# EAGLE design SNES_BOARD (EAGLE 7.7.0)
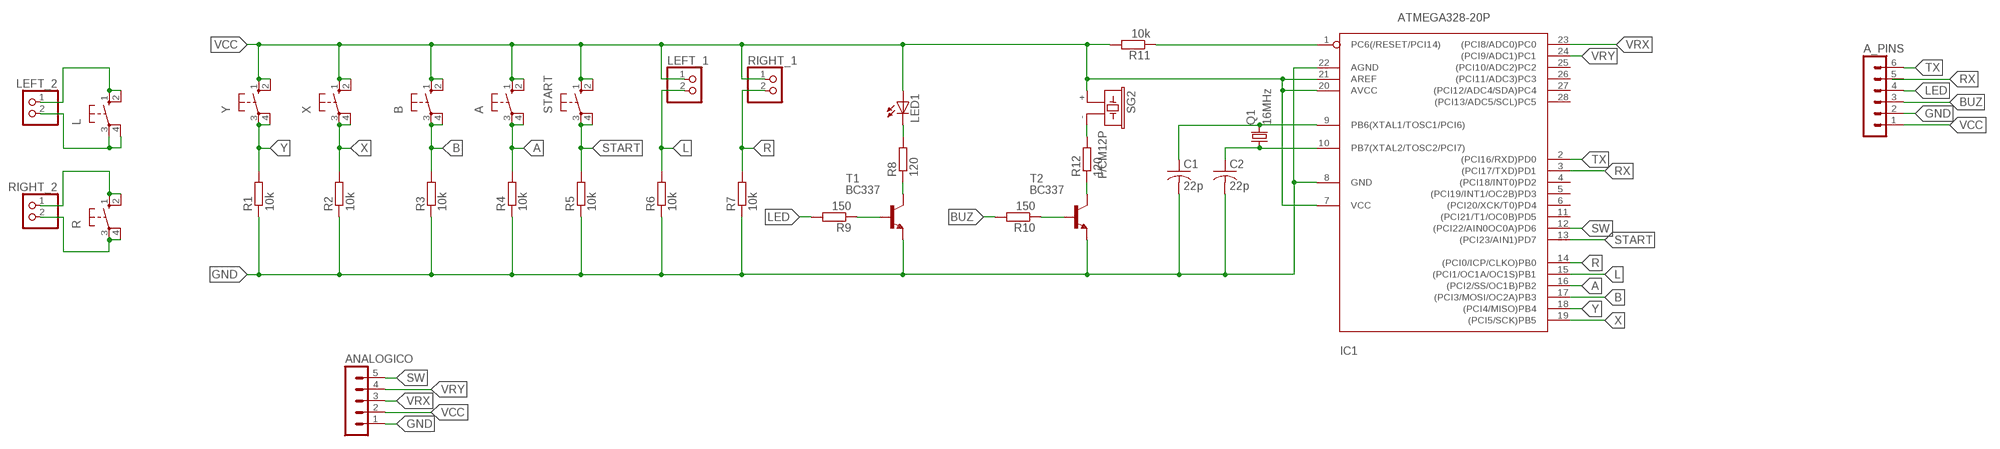
[diagram p0: schematic, sheet 1]

## Parts
A  10-XX  [B3F-10XX]
A_PINS  MA06-1  [MA06-1]
ANALOGICO  MA05-1  [MA05-1]
B  10-XX  [B3F-10XX]
C1  22p  C-US025-025X050  [C025-025X050]
C2  22p  C-US025-025X050  [C025-025X050]
IC1  ATMEGA328-20P  [DIL28-3]
L  10-XX  [B3F-10XX]
LED1  LED5MM  [LED5MM]
LEFT_1  PINHD-1X2  [1X02]
LEFT_2  PINHD-1X2  [1X02]
Q1  16MHz  CRYSTALHC49U-V  [HC49U-V]
R  10-XX  [B3F-10XX]
R1  10k  R-EU_0207/12  [0207/12]
R2  10k  R-EU_0207/12  [0207/12]
R3  10k  R-EU_0207/12  [0207/12]
R4  10k  R-EU_0207/12  [0207/12]
R5  10k  R-EU_0207/12  [0207/12]
R6  10k  R-EU_0207/12  [0207/12]
R7  10k  R-EU_0207/12  [0207/12]
R8  120  R-EU_0207/12  [0207/12]
R9  150  R-EU_0207/12  [0207/12]
R10  150  R-EU_0207/12  [0207/12]
R11  10k  R-EU_0207/12  [0207/12]
R12  120  R-EU_0207/12  [0207/12]
RIGHT_1  PINHD-1X2  [1X02]
RIGHT_2  PINHD-1X2  [1X02]
SG2  F/CM12P  [F/CM12P]
START  10-XX  [B3F-10XX]
T1  BC337  [TO92]
T2  BC337  [TO92]
X  10-XX  [B3F-10XX]
Y  10-XX  [B3F-10XX]

## Nets
A: A.3(P) A.4(P1) IC1.16((PCI2/SS/OC1B)PB2) R4.2
B: B.3(P) B.4(P1) IC1.17((PCI3/MOSI/OC2A)PB3) R3.2
BUZ: A_PINS.3 R10.2
GND: A_PINS.2 ANALOGICO.1 C1.2 C2.2 IC1.8(GND) IC1.22(AGND) R1.1 R2.1 R3.1 R4.1 R5.1 R6.1 R7.1 T1.1(E) T2.1(E)
L: IC1.15((PCI1/OC1A/OC1S)PB1) LEFT_1.2 R6.2
LED: A_PINS.4 R9.2
N$1: LED1.K(C) R8.2
N$2: L.1(S) L.2(S1) LEFT_2.1
N$3: L.3(P) L.4(P1) LEFT_2.2
N$4: R.1(S) R.2(S1) RIGHT_2.1
N$5: R.3(P) R.4(P1) RIGHT_2.2
N$6: R8.1 T1.3(C)
N$7: R9.1 T1.2(B)
N$8: R12.2 SG2.-
N$9: R10.1 T2.2(B)
N$10: IC1.1(PC6(/RESET/PCI14)) R11.1
N$13: C1.1 IC1.9(PB6(XTAL1/TOSC1/PCI6)) Q1.2
N$14: C2.1 IC1.10(PB7(XTAL2/TOSC2/PCI7)) Q1.1
N$18: R12.1 T2.3(C)
R: IC1.14((PCI0/ICP/CLKO)PB0) R7.2 RIGHT_1.2
RX: A_PINS.5 IC1.3((PCI17/TXD)PD1)
START: IC1.13((PCI23/AIN1)PD7) R5.2 START.3(P) START.4(P1)
SW: ANALOGICO.5 IC1.12((PCI22/AIN0OC0A)PD6)
TX: A_PINS.6 IC1.2((PCI16/RXD)PD0)
VCC: A.1(S) A.2(S1) A_PINS.1 ANALOGICO.2 B.1(S) B.2(S1) IC1.7(VCC) IC1.20(AVCC) IC1.21(AREF) LED1.A LEFT_1.1 R11.2 RIGHT_1.1 SG2.+ START.1(S) START.2(S1) X.1(S) X.2(S1) Y.1(S) Y.2(S1)
VRX: ANALOGICO.3 IC1.23((PCI8/ADC0)PC0)
VRY: ANALOGICO.4 IC1.24((PCI9/ADC1)PC1)
X: IC1.19((PCI5/SCK)PB5) R2.2 X.3(P) X.4(P1)
Y: IC1.18((PCI4/MISO)PB4) R1.2 Y.3(P) Y.4(P1)
Unconnected: IC1.4((PCI18/INT0)PD2) IC1.5((PCI19/INT1/OC2B)PD3) IC1.6((PCI20/XCK/T0)PD4) IC1.11((PCI21/T1/OC0B)PD5) IC1.25((PCI10/ADC2)PC2) IC1.26((PCI11/ADC3)PC3) IC1.27((PCI12/ADC4/SDA)PC4) IC1.28((PCI13/ADC5/SCL)PC5)

## Library data of the parts
A B L R START X Y = switch-omron:10-XX: OMRON SWITCH; MPN: B3F-1000; OC_FARNELL: 176432; OC_NEWARK: 36M3542
A_PINS = con-lstb:MA06-1: PIN HEADER; OC_FARNELL: unknown; OC_NEWARK: unknown
ANALOGICO = con-lstb:MA05-1: PIN HEADER; OC_FARNELL: unknown; OC_NEWARK: unknown
C1 C2 = adafruit:C-US: CAPACITOR, American symbol
IC1 = atmega328:ATMEGA328*P: MICROCONTROLLER 32 kBytes FLASH 2 kBytes SRAM 1 kBytes EEPROM USART 8-channel 10 bit ADC
LED1 = adafruit:LED: LED OSRAM: - CHIPLED LG R971, LG N971, LY N971, LG Q971, LY Q971, LO R971, LY R971 LH N974, LH R974 LS Q976, LO Q976, LY Q976 LO Q996 - Hyper CHIPLED LW Q18S LB Q993, LB Q99A, LB R99A - SideLED LS A670, LO A670, LY A670, LG A670, LP A670 LB A673, LV A673, LT A673, LW A673 LH A674 LY A675 LS A676, LA A676, LO A676, LY A676, LW A676 LS A679, LY A679, LG A679 - Hyper Micro SIDELED® LS Y876, LA Y876, LO Y876, LY Y876 LT Y87S - SmartLED LW L88C, LW L88S LB L89C, LB L89S, LG L890 LS L89K, LO L89K, LY L89K LS L896, LA L896, LO L896, LY L896 - TOPLED LS T670, LO T670, LY T670, LG T670, LP T670 LSG T670, LSP T670, LSY T670, LOP T670, LYG T670 LG T671, LOG T671, LSG T671 LB T673, LV T673, LT T673, LW T673 LH T674 LS T676, LA T676, LO T676, LY T676, LB T676, LH T676, LSB T676, LW T676 LB T67C, LV T67C, LT T67C, LS T67K, LO T67K, LY T67K, LW E67C LS E67B, LA E67B, LO E67B, LY E67B, LB E67C, LV E67C, LT E67C LW T67C LS T679, LY T679, LG T679 LS T770, LO T770, LY T770, LG T770, LP T770 LB T773, LV T773, LT T773, LW T773 LH T774 LS E675, LA E675, LY E675, LS T675 LS T776, LA T776, LO T776, LY T776, LB T776 LHGB T686 LT T68C, LB T68C - Hyper Mini TOPLED® LB M676 - Mini TOPLED Santana® LG M470 LS M47K, LO M47K, LY M47K Source: http://www.osram.convergy.de/
LEFT_1 LEFT_2 RIGHT_1 RIGHT_2 = pinhead:PINHD-1X2: PIN HEADER
Q1 = crystal:CRYSTAL: CRYSTAL; OC_FARNELL: 1666969; OC_NEWARK: unknown
R1-R12 = rcl:R-EU_: RESISTOR, European symbol
SG2 = buzzer:F/CM12P: BUZZER Source: Buerklin; OC_FARNELL: unknown; OC_NEWARK: unknown
T1 T2 = transistor:BC337: NPN TRANSISTOR

## Board
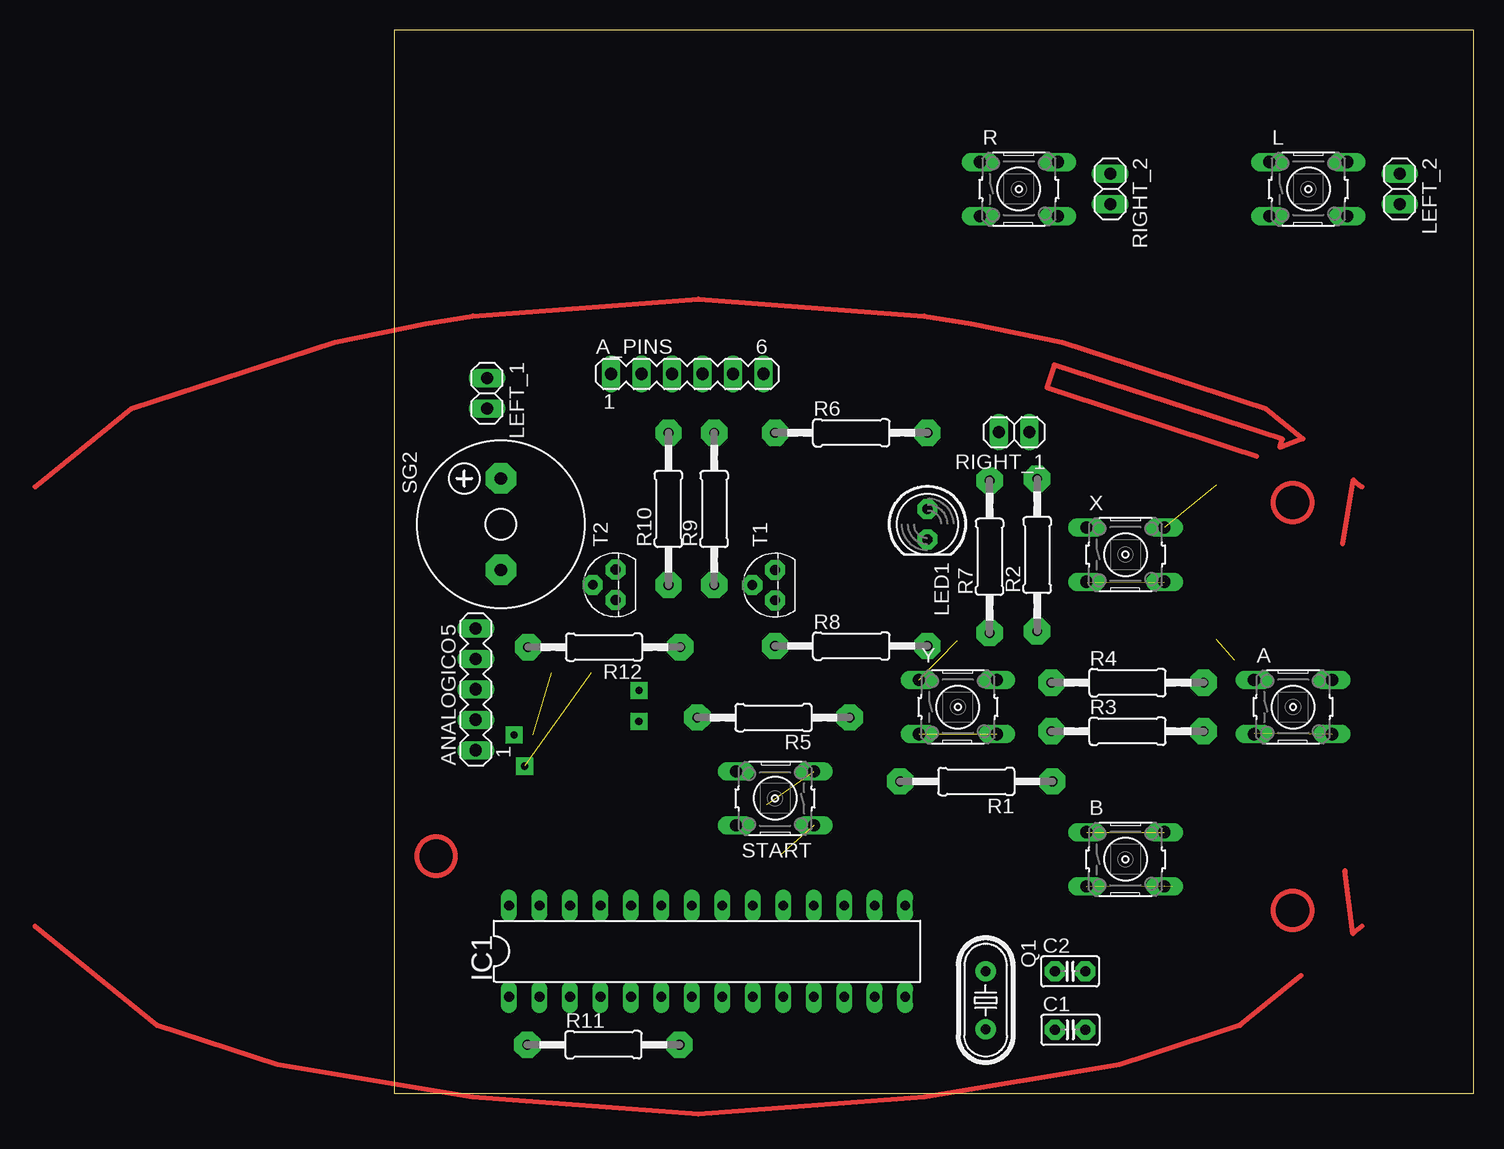
[diagram p1: board, top side]
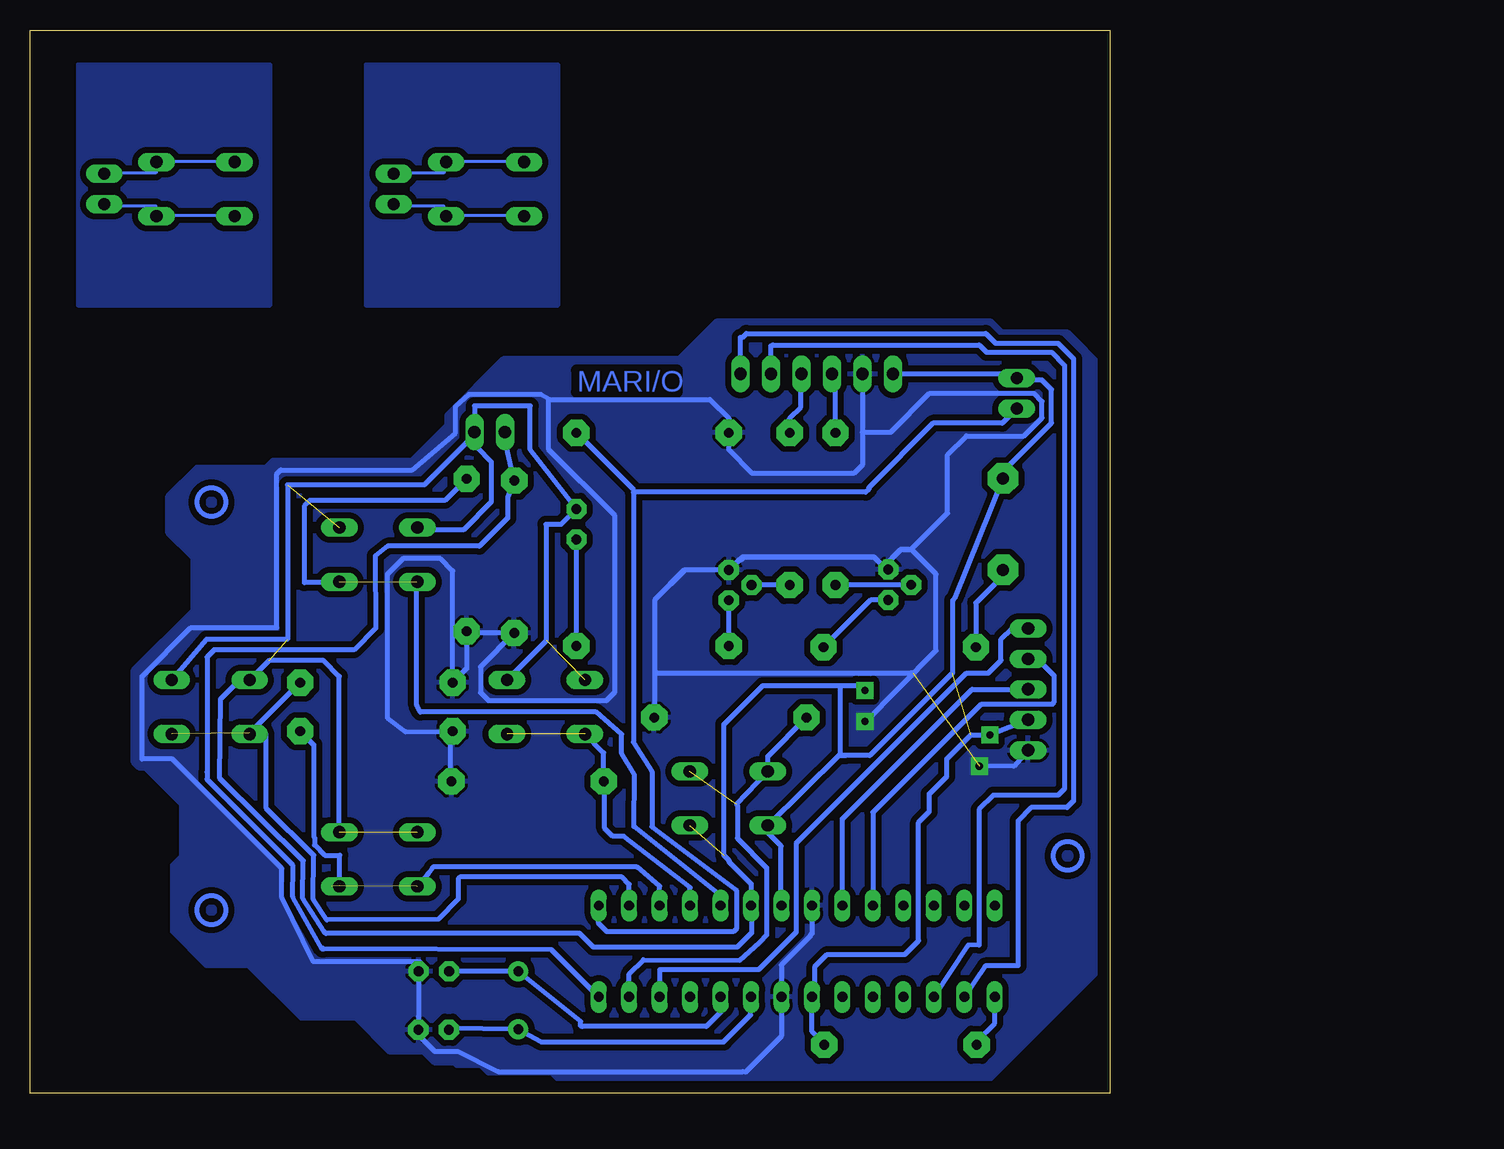
[diagram p2: board, bottom side, seen from below]

Size 90 x 88.65 mm. Coordinates in mm from the lower left corner, seen from the top.
Outline: 0,0 90,0 90,88.65 0,88.65 0,0
Copper layers (1*16): Top 0.035mm / dielectric 1.5mm / Bottom 0.035mm
Design rules "default *": minimum track width 30mil, minimum drill 24mil, track to track 10mil, track to pad 20mil, pad to pad 8mil, via to via 8mil, smd to smd 8mil, copper to edge 40mil, drill to drill 8mil, minimum pad ring 10mil, minimum via ring 8mil, stop-mask expansion 4mil, vias tented up to drill 0mil, thermal gap 10mil

### Footprints (pad centres in the part's own frame; a part is rotated, then mirrored left to right if it is on the bottom)
B3F-10XX = drill 1.016 long: 1 -3.251,2.261; 2 3.251,2.261; 3 -3.251,-2.261; 4 3.251,-2.261
MA06-1 = drill 1.016 long: 1 -6.35,0; 2 -3.81,0; 3 -1.27,0; 4 1.27,0; 5 3.81,0; 6 6.35,0
MA05-1 = drill 1.016 long: 1 -5.08,0; 2 -2.54,0; 3 0,0; 4 2.54,0; 5 5.08,0
C025-025X050 = drill 0.813 pad 1.676 octagon: 1 -1.27,0; 2 1.27,0
DIL28-3 = drill 0.813 long: 1 -16.51,-3.81; 2 -13.97,-3.81; 3 -11.43,-3.81; 4 -8.89,-3.81; 5 -6.35,-3.81; 6 -3.81,-3.81; 7 -1.27,-3.81; 8 1.27,-3.81; 9 3.81,-3.81; 10 6.35,-3.81; 11 8.89,-3.81; 12 11.43,-3.81; 13 13.97,-3.81; 14 16.51,-3.81; 15 16.51,3.81; 16 13.97,3.81; 17 11.43,3.81; 18 8.89,3.81; 19 6.35,3.81; 20 3.81,3.81; 21 1.27,3.81; 22 -1.27,3.81; 23 -3.81,3.81; 24 -6.35,3.81; 25 -8.89,3.81; 26 -11.43,3.81; 27 -13.97,3.81; 28 -16.51,3.81
LED5MM = drill 0.813 pad 1.676 octagon: A -1.27,0; K 1.27,0
1X02 = drill 1.016 long: 1 -1.27,0; 2 1.27,0
HC49U-V = drill 0.813 pad 1.676: 1 -2.413,0; 2 2.413,0
0207/12 = drill 0.813 pad 2.184 octagon: 1 -6.35,0; 2 6.35,0
F/CM12P = drill 1.016 pad 2.54 octagon: + 3.81,0; - -3.81,0
TO92 = drill 0.813 pad 1.676 octagon: 1 1.27,0; 2 0,1.905; 3 -1.27,0

### Placement (x,y rotation side)
A  74.93,32.21 0 top
A_PINS  24.42,59.98 0 top
ANALOGICO  6.79,33.69 90 top
B  60.96,19.51 0 top
C1  56.35,5.3 0 top
C2  56.34,10.18 0 top
IC1  26.08,11.85 0 top
L  76.2,75.39 0 top
LED1  44.45,47.45 270 top
LEFT_1  7.74,58.35 270 top
LEFT_2  83.82,75.39 270 top
Q1  49.3,7.76 270 top
R  52.07,75.39 0 top
R1  48.52,26 180 top
R2  53.6,44.88 90 top
R3  61.12,30.19 0 top
R4  61.12,34.24 0 top
R5  31.61,31.33 180 top
R6  38.1,55.07 0 top
R7  49.63,44.73 90 top
R8  38.1,37.29 0 top
R9  26.67,48.72 90 top
R10  22.86,48.72 90 top
R11  17.44,4.05 0 top
R12  17.5,37.2 180 top
RIGHT_1  51.69,55.13 180 top
RIGHT_2  59.69,75.39 270 top
SG2  8.89,47.45 90 top
START  31.75,24.59 180 top
T1  31.75,42.37 90 top
T2  18.45,42.39 90 top
X  60.96,44.91 0 top
Y  46.99,32.21 0 top

### Tracks (layer width: path | path; a pad name or v marks a point on that pad's centre or on a via)
A  (1 unrouted)
  Bottom 0.406: IC1.16 40.05,17.44 40.66,18.05 54.16,18.05 54.3,17.91 54.3,16.2 55.98,14.52 65.26,14.47 66.39,16.17 66.35,19.85 70.3,23.78 70.32,29.94 A.3 71.68,30.04 R4.2
B  (2 unrouted)
  Top 0.406: 64.85,17.25 64.85,17.32 | 64.21,17.32 B.4
  Bottom 0.406: IC1.17 37.51,17.27 39.41,18.87 56.41,18.87 56.44,18.8 56.82,18.31 B.3 | R3.2 66.35,29.06 66.35,21.39 66.29,21.33 66.29,20.71 65.43,19.85 64.18,19.85 64.21,19.82 B.4
BUZ
  Bottom 0.406: R10.2 22.86,59.69 A_PINS.3
GND  (via drill 0.6 pad 1.42)  (1 unrouted)
  Bottom 0.406: 37.92,35.23 37.92,31.38 R5.1 | IC1.22 24.81,13.34 24.95,13.2 24.95,13.12 27.36,10.71 27.36,8.05 IC1.8 27.32,8.01 27.32,4.81 30.37,1.77 30.31,1.82 30.6,1.82 50.96,1.82 54.34,3.49 56.26,3.49 57.62,4.85 C1.2 57.61,6.39 57.61,10.85 57.49,10.97 | C2.2 57.49,10.97 | T2.1 18.75,43.43 18.86,43.93 | 18.86,43.93 19.65,44.72 30.49,44.72 30.72,44.48 30.91,44.48 T1.1 35.4,43.64 37.92,41.12 37.92,35.23 | A_PINS.2 20.62,59.97 20.62,55.11 | 20.62,55.11 20.62,52.38 21.32,51.69 29.78,51.69 31.75,53.65 R6.1 31.75,56.29 33.32,57.86 46.7,57.86 | ANALOGICO.1 7.99,27.28 v10.87,27.28 | v20.39,31 20.49,30.83 14.48,36.92 14.48,43.28 16.52,45.32 17.47,45.32 18.86,43.93 | 54.77,29.85 54.98,29.65 54.98,26.11 R1.1 | R3.1 58.69,30.15 60.22,31.3 60.22,43.26 58.91,44.58 55.78,44.58 54.75,43.55 54.75,34.27 R4.1 53.6,35.42 R2.1 53.45,38.38 R7.1 52.45,35.57 52.45,33.41 51.78,32.74 41.96,32.74 41.25,33.45 41.25,48.17 46.75,53.68 46.75,57.81 46.7,57.86 | 37.92,35.23 37.72,35.03 17.59,35.03 16.4,35.04 16.61,35.04 16.7,35.01 16.83,35.01 | 37.92,35.23 37.89,35.26 37.89,41.19 35.42,43.66 31.66,43.66 30.59,44.73 19.66,44.73 18.67,43.74 18.64,43.74 18.53,43.85 18.53,44.21 17.41,45.33 16.56,45.33 13.51,48.38 13.51,53.24 11.94,54.81 7.14,54.81 5.63,56.32 5.63,57.69 6.26,58.32 15.05,58.32 18.26,55.11 20.62,55.11 | 57.49,10.97 57.51,10.99 66.38,10.99 69.02,16.34 69.02,18.76 78.14,27.88 80.65,27.88 80.65,34.78 76.6,38.82 69.43,38.82 69.43,51.64 69.09,51.97 58.13,51.97 54.53,55.06 54.53,57.29 53.41,58.29 47.43,58.29 46.7,57.88 46.7,57.86
  pour Bottom (isolate 0.508): 0.47,60.43 3.49,63.45 8.96,63.45 9.89,64.38 32.79,64.38 35.92,61.25 50.55,61.25 55.29,56.5 55.29,55.68 58.19,52.78 69.76,52.78 70.35,52.18 76.12,52.18 78.55,49.74 78.55,46.78 76.45,44.67 76.45,40.22 81.42,35.25 81.42,27.63 80.93,27.14 80.4,27.14 77.4,24.14 77.4,19.73 78.16,18.97 78.16,13.53 75.29,10.66 71.8,10.66 67.42,6.28 62.87,6.28 60.07,3.48 57.23,3.48 56.31,2.56 54.66,2.56 54.43,2.33 52.42,2.33 51.8,1.7 46.53,1.7 45.74,0.91 10.27,0.91 10.2,0.97 0.46,10.72 0.46,19.37
L
  Bottom 0.406: R6.2 39.7,50.32 39.7,50.12 | 39.7,50.12 39.7,29.26 38.16,26.85 38.16,22.22 31.16,16.96 31.12,16.92 31.12,13.72 31.36,13.48 41.91,13.48 42.59,14.16 IC1.15 | LEFT_1.2 8.96,55.87 14.71,55.87 20.08,50.5 20.08,50.36 20.32,50.12 39.7,50.12
LED
  Bottom 0.406: R9.2 26.67,56.29 25.74,57.22 25.74,59.93 A_PINS.4
N$1
  Bottom 0.406: R8.2 LED1.K
N$2
  Bottom 0.25: L.1 73,77.73 79.25,77.73 L.2 79.5,77.48 79.5,76.73 83.75,76.73 LEFT_2.1
N$3
  Bottom 0.25: L.3 73,73.23 79.25,73.23 L.4 79.5,73.23 79.5,73.98 83.75,73.98 LEFT_2.2
N$4
  Bottom 0.25: R.1 49,77.73 55.25,77.73 R.2 55.5,77.48 55.5,76.73 59.5,76.73 RIGHT_2.1
N$5
  Bottom 0.25: R.3 49,73.23 55.25,73.23 R.4 55.5,73.23 55.5,73.98 59.5,73.98 RIGHT_2.2
N$6
  Bottom 0.406: R8.1 T1.3
N$7
  Bottom 0.406: R9.1 T1.2
N$8
  Bottom 0.406: SG2.- 8.89,43.15 11.15,40.89 R12.2
N$9
  Bottom 0.406: R10.1 22.84,42.39 T2.2
N$10
  Bottom 0.406: R11.1 11.09,4.32 9.57,5.85 IC1.1
N$11
  Top 0.406: 80.67,13.94 79.92,13.34 79.26,18.58
N$12
  pour Bottom (isolate 0.508): 46,65.73 46,85.73 62,85.73 62,65.73
N$13
  Bottom 0.406: IC1.9 29.93,8 29.93,6.54 32.18,4.29 47.39,4.29 49.41,5.4 Q1.2 55.24,5.42 C1.1
N$14
  Bottom 0.406: C2.1 54.74,10.17 Q1.1 44.1,6 44.1,5.6 43.96,5.58 33.61,5.58 32.43,6.75 IC1.10
N$15
  Top 0.406: 79.06,45.81 79.95,51.14 80.67,50.56
N$16
  Top 0.406: 75.58,9.8 70.49,5.66 60.44,2.39 44.17,-0.31 25.36,-1.72 6.54,-0.31 -9.73,2.39 -19.78,5.66 -29.96,13.94
N$17
  Top 0.406: -29.96,50.56 -21.94,57.09 -4.94,62.63 2.6,64.16 6.54,64.81 25.36,66.23 44.17,64.81 48.11,64.16 55.65,62.63 72.65,57.09 75.74,54.57 73.83,53.86 74.05,54.53 55.03,60.73 54.41,58.83 71.88,53.13
N$18
  Bottom 0.406: T2.3 19.92,41.12 R12.1
N$19
  pour Bottom (isolate 0.508): 70,65.73 70,85.73 86,85.73 86,65.73
R
  Bottom 0.406: RIGHT_1.2 50.53,55.01 R7.2 50.18,49.68 50.18,47.95 52.54,45.62 60.19,45.62 61.23,44.81 61.17,38.79 62.99,36.97 74.65,36.97 75.25,36.38 75.25,26.79 75.24,26.18 68.06,19 68.06,18.89 68.09,16.37 65.63,12.02 65.6,12.11 65.55,12.04 46.53,11.98 IC1.14
RX
  Bottom 0.406: A_PINS.5 28.23,62.33 28.16,62.33 28.09,62.4 10.87,62.4 10.25,61.79 4.85,61.79 3.76,60.69 3.76,25.4 4.31,24.85 9.7,24.85 10.88,23.67 10.88,12.38 11.8,12.36 IC1.3
START  (1 unrouted)
  Bottom 0.406: R5.2 28.5,28.1 START.4 31.09,24.07 31.04,24.03 31.04,21.27 28.59,18.82 28.59,13.2 29.18,12.61 29.19,12.58 30.85,11.11 38.87,11.13 40.05,9.96 IC1.13
SW
  Bottom 0.406: 6.83,38.73 ANALOGICO.5 8.16,38.77 9.05,37.88 9.05,36.1 10.11,35.04 11.93,35.04 26.14,20.84 26.14,13.44 29.26,10.32 37.48,10.32 37.51,10.29 IC1.12
TX
  Bottom 0.406: A_PINS.6 30.77,63.02 30.62,63.02 30.28,63.36 10.32,63.36 9.5,62.54 4.31,62.54 3.01,61.24 3.01,24.37 3.56,23.83 6.55,23.83 7.64,22.73 7.64,10.64 10.36,10.63 IC1.2 12.08,8.04
VCC  (via drill 0.6 pad 1.42)  (6 unrouted)
  Top 0.406: B.1 57.73,21.77 57.73,21.75 | 64.21,21.75 B.2
  Bottom 0.406: R11.2 23.79,4.13 24.79,5.13 24.79,8.02 IC1.7 24.55,8.31 24.55,10.6 23.56,11.59 17.07,11.59 15.93,12.74 15.93,22.59 15.02,23.49 15.02,24.97 13.57,26.42 13.57,27.9 11.58,29.89 v9.98,29.89 ANALOGICO.2 | A_PINS.1 8.1,59.98 LEFT_1.1 7.6,59.48 5.65,59.48 4.85,58.68 4.85,55.89 8.89,51.85 SG2.+ 12.88,41.33 13.1,41.1 13.1,35.06 20,28.17 22.5,28.17 | IC1.21 27.38,15.69 27.38,20.62 28.5,21.73 START.2 22.58,28.17 22,28.17 22.5,28.17 | v20.4,33.6 20.96,33.96 | 20.96,33.96 22.5,33.96 22.5,28.17 | 52.73,55.13 RIGHT_1.1 52.95,57.32 48.29,57.32 48.29,53.66 LED1.A 45.71,47.46 46.99,47.46 46.94,47.41 46.94,37.77 Y.2 | X.1 57.52,46.99 53.87,46.99 51.55,49.31 51.55,52.64 52.73,53.82 52.73,55.13 | 20.96,33.96 22.02,34 28.9,34 32.15,30.76 32.15,19.85 31.71,19.41 31.71,19.29 29.89,17.47 IC1.20 29.85,15.62 29.85,13.38 31.04,12.19 43.03,12.19 44.2,13.36 65.31,13.36 65.33,13.33 65.49,13.47 67.26,16.25 67.23,19.39 74.17,26.28 74.12,32.87 72.52,34.47 A.1 70.07,36.09 65.52,36.09 64.21,34.78 B.2 | 52.73,55.13 57.13,50.73 68.52,50.73 68.52,37.85 75.3,37.85 A.2
VRX
  Bottom 0.406: IC1.23 22.3,15.69 22.3,22.85 11.46,33.69 ANALOGICO.3
VRY
  Bottom 0.406: IC1.24 19.73,23.44 10.68,32.45 4.76,32.45 4.61,32.65 4.61,34.81 6.03,36.23 ANALOGICO.4
X  (1 unrouted)
  Bottom 0.406: IC1.19 32.43,16.52 39.66,22.25 39.62,26.56 40.68,28.32 40.68,29.94 42.81,31.79 57.48,31.79 57.76,32.36 57.76,42.6 X.3 | R2.2 55.4,49.43 66.67,49.43 67.14,48.95 67.14,42.59 67.07,42.65 X.4
Y  (1 unrouted)
  Bottom 0.406: IC1.18 34.97,17.16 40.52,21.44 41.44,21.44 42.1,22.1 42.1,25.93 R1.2 42.17,28.39 Y.3
(copper drawn outside any net)
  shapes: Bottom circle x3, Top circle x3

### Text on the board
Bottom: MARI/O